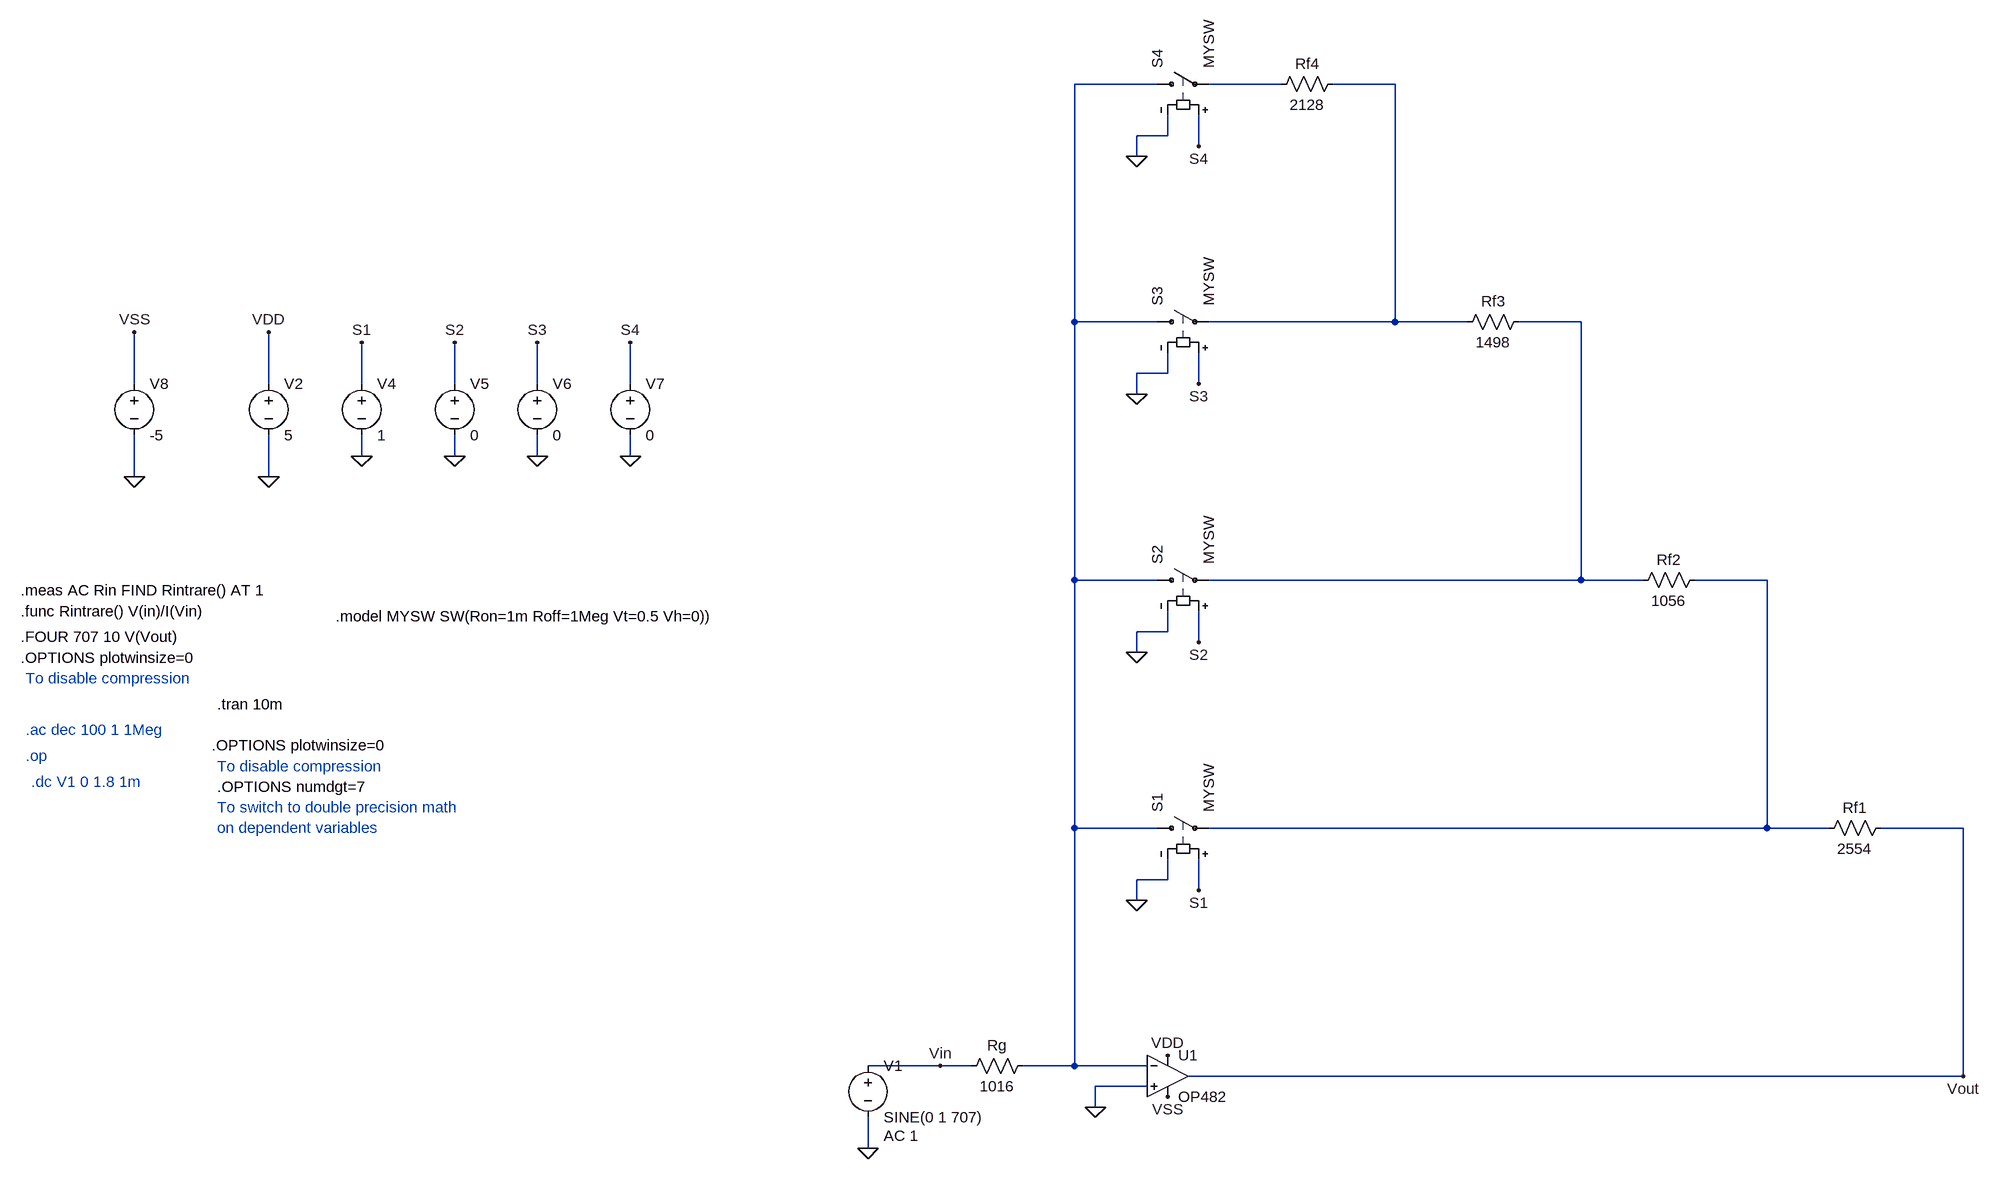
[diagram p0: schematic PGA_inversor_4trepte.asc]
PGA_inversor_4trepte.asc, the LTspice schematic file:
Version 4
SHEET 1 1820 2436
WIRE 224 -704 96 -704
WIRE 416 -704 304 -704
WIRE 592 -704 496 -704
WIRE 240 -624 240 -656
WIRE 240 -624 192 -624
WIRE 288 -608 288 -656
WIRE 192 -592 192 -624
WIRE 96 -336 96 -704
WIRE 224 -336 96 -336
WIRE 592 -336 592 -704
WIRE 592 -336 304 -336
WIRE 704 -336 592 -336
WIRE 880 -336 784 -336
WIRE 240 -256 240 -288
WIRE 240 -256 192 -256
WIRE -1360 -240 -1360 -320
WIRE -1152 -240 -1152 -320
WIRE -1008 -240 -1008 -304
WIRE -864 -240 -864 -304
WIRE -736 -240 -736 -304
WIRE -592 -240 -592 -304
WIRE 288 -240 288 -288
WIRE 192 -224 192 -256
WIRE -1008 -128 -1008 -160
WIRE -864 -128 -864 -160
WIRE -736 -128 -736 -160
WIRE -592 -128 -592 -160
WIRE -1360 -96 -1360 -160
WIRE -1152 -96 -1152 -160
WIRE 96 64 96 -336
WIRE 224 64 96 64
WIRE 880 64 880 -336
WIRE 880 64 304 64
WIRE 976 64 880 64
WIRE 1168 64 1056 64
WIRE 240 144 240 112
WIRE 240 144 192 144
WIRE 288 160 288 112
WIRE 192 176 192 144
WIRE 96 448 96 64
WIRE 224 448 96 448
WIRE 1168 448 1168 64
WIRE 1168 448 304 448
WIRE 1264 448 1168 448
WIRE 1472 448 1344 448
WIRE 240 528 240 496
WIRE 240 528 192 528
WIRE 288 544 288 496
WIRE 192 560 192 528
WIRE -112 816 -224 816
WIRE -64 816 -112 816
WIRE 96 816 96 448
WIRE 96 816 16 816
WIRE 208 816 96 816
WIRE 1472 832 1472 448
WIRE 1472 832 272 832
WIRE 208 848 128 848
WIRE 128 880 128 848
WIRE -224 944 -224 896
FLAG -1152 -96 0
FLAG -1152 -320 VDD
FLAG -1008 -128 0
FLAG -1008 -304 S1
FLAG -864 -128 0
FLAG -864 -304 S2
FLAG -736 -128 0
FLAG -736 -304 S3
FLAG -592 -128 0
FLAG -592 -304 S4
FLAG 240 864 VSS
FLAG -1360 -96 0
FLAG -1360 -320 VSS
FLAG 288 544 S1
FLAG 192 560 0
FLAG 288 160 S2
FLAG 192 176 0
FLAG 288 -240 S3
FLAG 192 -224 0
FLAG 288 -608 S4
FLAG 192 -592 0
FLAG 240 800 VDD
FLAG 128 880 0
FLAG -224 944 0
FLAG -112 816 Vin
FLAG 1472 832 Vout
SYMBOL voltage -1152 -256 R0
WINDOW 123 0 0 Left 2
WINDOW 39 0 0 Left 2
SYMATTR InstName V2
SYMATTR Value 5
SYMBOL voltage -1008 -256 R0
WINDOW 123 0 0 Left 2
WINDOW 39 0 0 Left 2
SYMATTR InstName V4
SYMATTR Value 1
SYMBOL voltage -864 -256 R0
WINDOW 123 0 0 Left 2
WINDOW 39 0 0 Left 2
SYMATTR InstName V5
SYMATTR Value 0
SYMBOL voltage -736 -256 R0
WINDOW 123 0 0 Left 2
WINDOW 39 0 0 Left 2
SYMATTR InstName V6
SYMATTR Value 0
SYMBOL voltage -592 -256 R0
WINDOW 123 0 0 Left 2
WINDOW 39 0 0 Left 2
SYMATTR InstName V7
SYMATTR Value 0
SYMBOL sw 208 448 R270
SYMATTR InstName S1
SYMATTR Value MYSW
SYMBOL sw 208 64 R270
SYMATTR InstName S2
SYMATTR Value MYSW
SYMBOL sw 208 -336 R270
SYMATTR InstName S3
SYMATTR Value MYSW
SYMBOL sw 208 -704 R270
SYMATTR InstName S4
SYMATTR Value MYSW
SYMBOL voltage -1360 -256 R0
WINDOW 123 0 0 Left 2
WINDOW 39 0 0 Left 2
SYMATTR InstName V8
SYMATTR Value -5
SYMBOL OpAmps\\OP482 240 768 R0
SYMATTR InstName U1
SYMBOL voltage -224 800 R0
WINDOW 123 24 124 Left 2
WINDOW 39 0 0 Left 0
SYMATTR Value2 AC 1
SYMATTR InstName V1
SYMATTR Value SINE(0 1 707)
SYMBOL res 32 800 R90
WINDOW 0 0 56 VBottom 2
WINDOW 3 32 56 VTop 2
SYMATTR InstName Rg
SYMATTR Value 1016
SYMBOL res 512 -720 R90
WINDOW 0 0 56 VBottom 2
WINDOW 3 32 56 VTop 2
SYMATTR InstName Rf4
SYMATTR Value 2128
SYMBOL res 800 -352 R90
WINDOW 0 0 56 VBottom 2
WINDOW 3 32 56 VTop 2
SYMATTR InstName Rf3
SYMATTR Value 1498
SYMBOL res 1072 48 R90
WINDOW 0 0 56 VBottom 2
WINDOW 3 32 56 VTop 2
SYMATTR InstName Rf2
SYMATTR Value 1056
SYMBOL res 1360 432 R90
WINDOW 0 0 56 VBottom 2
WINDOW 3 32 56 VTop 2
SYMATTR InstName Rf1
SYMATTR Value 2554
TEXT -1528 296 Left 2 ;.ac dec 100 1 1Meg
TEXT -1528 336 Left 2 ;.op
TEXT -1232 256 Left 2 !.tran 10m
TEXT -1240 320 Left 2 !.OPTIONS plotwinsize=0
TEXT -1232 352 Left 2 ;To disable compression
TEXT -1232 384 Left 2 !.OPTIONS numdgt=7
TEXT -1232 416 Left 2 ;To switch to double precision math\non dependent variables
TEXT -1536 80 Left 2 !.meas AC Rin FIND Rintrare() AT 1
TEXT -1536 112 Left 2 !.func Rintrare() V(in)/I(Vin)
TEXT -1536 152 Left 2 !.FOUR 707 10 V(Vout)
TEXT -1536 184 Left 2 !.OPTIONS plotwinsize=0
TEXT -1528 216 Left 2 ;To disable compression
TEXT -1520 376 Left 2 ;.dc V1 0 1.8 1m
TEXT -1048 120 Left 2 !.model MYSW SW(Ron=1m Roff=1Meg Vt=0.5 Vh=0))

The netlist it stands for:
* PGA_inversor_4trepte.asc
V2 VDD 0 5
V4 S1 0 1
V5 S2 0 0
V6 S3 0 0
V7 S4 0 0
S1 N001 N005 S1 0 MYSW
S2 N001 N004 S2 0 MYSW
S3 N001 N003 S3 0 MYSW
S4 N001 N002 S4 0 MYSW
V8 VSS 0 -5
XU1 0 N001 VDD VSS Vout OP482  ; pins In+ In- V+ V- OUT
V1 Vin 0 SINE(0 1 707) AC 1
Rg N001 Vin 1016
Rf4 N003 N002 2128
Rf3 N004 N003 1498
Rf2 N005 N004 1056
Rf1 Vout N005 2554
* .ac dec 100 1 1Meg
* .op
.tran 10m
.OPTIONS plotwinsize=0
* To disable compression
.OPTIONS numdgt=7
* To switch to double precision math
* on dependent variables
.meas AC Rin FIND Rintrare() AT 1
.func Rintrare() V(in)/I(Vin)
.FOUR 707 10 V(Vout)
.OPTIONS plotwinsize=0
* To disable compression
* .dc V1 0 1.8 1m
.model MYSW SW(Ron=1m Roff=1Meg Vt=0.5 Vh=0))
.backanno
.end